# EAGLE design UwU Bot (EAGLE 9.6.2)
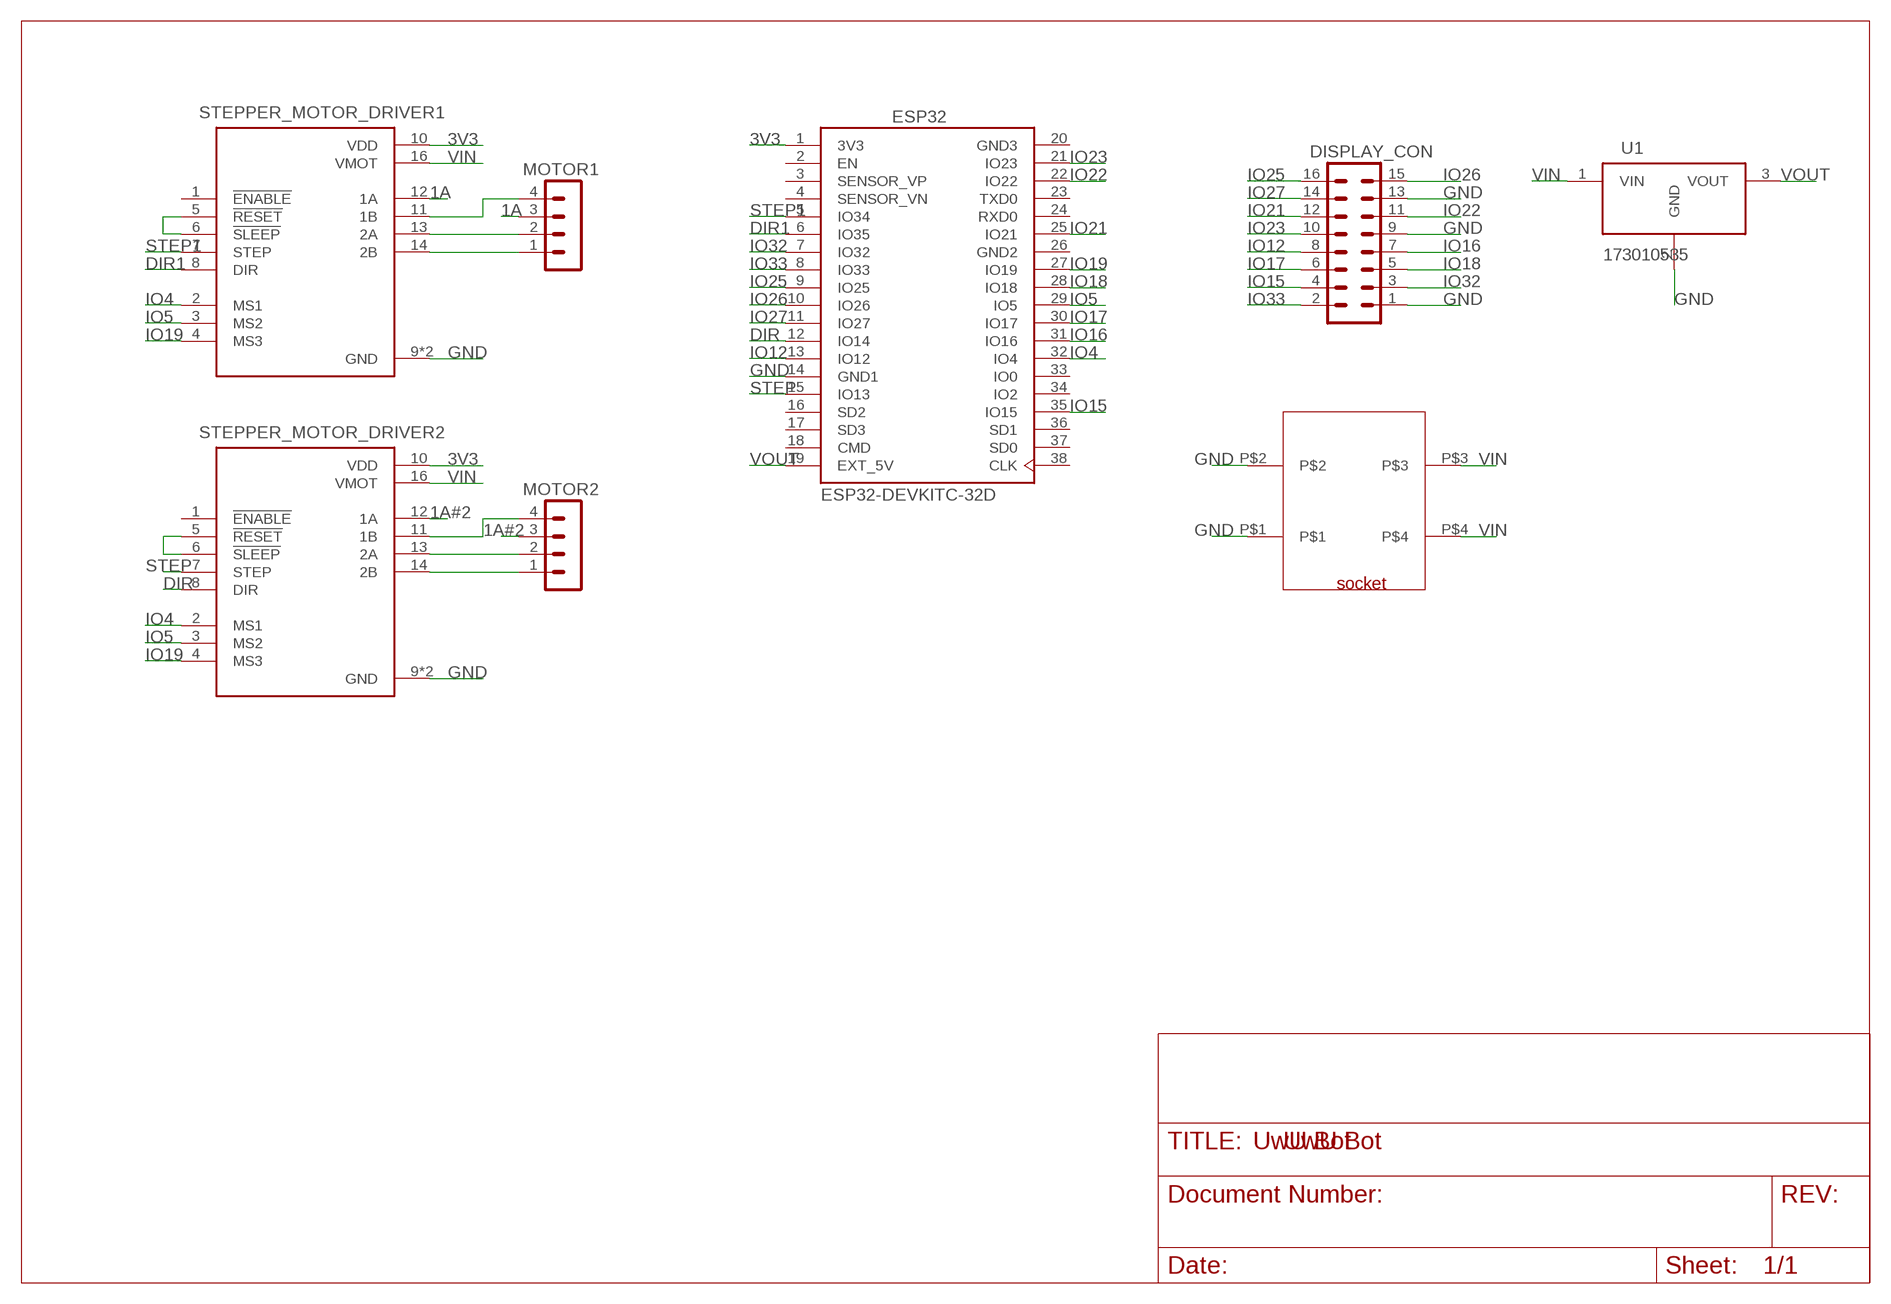
[diagram p0: schematic, sheet 1]

## Parts
DISPLAY_CON  MA08-2  [MA08-2]
ESP32  ESP32-DEVKITC-32D  [MODULE_ESP32-DEVKITC-32D]
MOTOR1  MA04-1  [MA04-1]
MOTOR2  MA04-1  [MA04-1]
STEPPER_MOTOR_DRIVER1  A4988_STEPPER_MOTOR_DRIVER_CARRIER_BLACK  [MODULE_A4988_STEPPER_MOTOR_DRIVER_CARRIER_BLACK]
STEPPER_MOTOR_DRIVER2  A4988_STEPPER_MOTOR_DRIVER_CARRIER_BLACK  [MODULE_A4988_STEPPER_MOTOR_DRIVER_CARRIER_BLACK]
U1  173010535  [173010535]
U$1  BUCHSEDC  [BUCHSE]

## Nets
1A: MOTOR1.3 STEPPER_MOTOR_DRIVER1.12(1A)
1A#2: MOTOR2.3 STEPPER_MOTOR_DRIVER2.12(1A)
3V3: ESP32.1(3V3) STEPPER_MOTOR_DRIVER1.10(VDD) STEPPER_MOTOR_DRIVER2.10(VDD)
DIR: ESP32.12(IO14) STEPPER_MOTOR_DRIVER2.8(DIR)
DIR1: ESP32.6(IO35) STEPPER_MOTOR_DRIVER1.8(DIR)
GND: DISPLAY_CON.1 DISPLAY_CON.9 DISPLAY_CON.13 ESP32.14(GND1) STEPPER_MOTOR_DRIVER1.9(GND) STEPPER_MOTOR_DRIVER1.15(GND) STEPPER_MOTOR_DRIVER2.9(GND) STEPPER_MOTOR_DRIVER2.15(GND) U1.2(GND) U$1.P$1 U$1.P$2
IO4: ESP32.32(IO4) STEPPER_MOTOR_DRIVER1.2(MS1) STEPPER_MOTOR_DRIVER2.2(MS1)
IO5: ESP32.29(IO5) STEPPER_MOTOR_DRIVER1.3(MS2) STEPPER_MOTOR_DRIVER2.3(MS2)
IO12: DISPLAY_CON.8 ESP32.13(IO12)
IO15: DISPLAY_CON.4 ESP32.35(IO15)
IO16: DISPLAY_CON.7 ESP32.31(IO16)
IO17: DISPLAY_CON.6 ESP32.30(IO17)
IO18: DISPLAY_CON.5 ESP32.28(IO18)
IO19: ESP32.27(IO19) STEPPER_MOTOR_DRIVER1.4(MS3) STEPPER_MOTOR_DRIVER2.4(MS3)
IO21: DISPLAY_CON.12 ESP32.25(IO21)
IO22: DISPLAY_CON.11 ESP32.22(IO22)
IO23: DISPLAY_CON.10 ESP32.21(IO23)
IO25: DISPLAY_CON.16 ESP32.9(IO25)
IO26: DISPLAY_CON.15 ESP32.10(IO26)
IO27: DISPLAY_CON.14 ESP32.11(IO27)
IO32: DISPLAY_CON.3 ESP32.7(IO32)
IO33: DISPLAY_CON.2 ESP32.8(IO33)
N$1: MOTOR1.4 STEPPER_MOTOR_DRIVER1.11(1B)
N$2: STEPPER_MOTOR_DRIVER1.5(!RESET) STEPPER_MOTOR_DRIVER1.6(!SLEEP)
N$3: STEPPER_MOTOR_DRIVER2.5(!RESET) STEPPER_MOTOR_DRIVER2.6(!SLEEP)
N$4: MOTOR2.4 STEPPER_MOTOR_DRIVER2.11(1B)
N$26: MOTOR2.2 STEPPER_MOTOR_DRIVER2.13(2A)
N$27: MOTOR2.1 STEPPER_MOTOR_DRIVER2.14(2B)
N$28: MOTOR1.1 STEPPER_MOTOR_DRIVER1.14(2B)
N$29: MOTOR1.2 STEPPER_MOTOR_DRIVER1.13(2A)
STEP: ESP32.15(IO13) STEPPER_MOTOR_DRIVER2.7(STEP)
STEP1: ESP32.5(IO34) STEPPER_MOTOR_DRIVER1.7(STEP)
VIN: STEPPER_MOTOR_DRIVER1.16(VMOT) STEPPER_MOTOR_DRIVER2.16(VMOT) U1.1(VIN) U$1.P$3 U$1.P$4
VOUT: ESP32.19(EXT_5V) U1.3(VOUT)
Unconnected: ESP32.2(EN) ESP32.3(SENSOR_VP) ESP32.4(SENSOR_VN) ESP32.16(SD2) ESP32.17(SD3) ESP32.18(CMD) ESP32.23(TXD0) ESP32.24(RXD0) ESP32.33(IO0) ESP32.34(IO2) ESP32.36(SD1) ESP32.37(SD0) ESP32.38(CLK) STEPPER_MOTOR_DRIVER1.1(!ENABLE) STEPPER_MOTOR_DRIVER2.1(!ENABLE)

## Notes on the sheet
- UwU Bot

## Power pins joined to a net without a drawn wire
GND2: ESP32.26(GND2)
GND3: ESP32.20(GND3)

## Library data of the parts
DISPLAY_CON = con-lstb:MA08-2: PIN HEADER; OC_FARNELL: unknown; OC_NEWARK: unknown
ESP32 = ESP32-DEVKITC-32D:ESP32-DEVKITC-32D: Eval Board For Esp-Wroom-32 Check availability <https://pricing.snapeda.com/parts/ESP32-DEVKITC-32D/Espressif%20Systems/view-part?ref=eda>; AVAILABILITY: In Stock; DESCRIPTION: WiFi Development Tools (802.11) ESP32 General Development Kit, ESP32-WROOM-32D on the board; MF: Espressif Systems; MP: ESP32-DEVKITC-32D; PACKAGE: None; PRICE: None; PURCHASE-URL: https://pricing.snapeda.com/search/part/ESP32-DEVKITC-32D/?ref=eda
MOTOR1 MOTOR2 = con-lstb:MA04-1: PIN HEADER; OC_FARNELL: unknown; OC_NEWARK: unknown
STEPPER_MOTOR_DRIVER1 STEPPER_MOTOR_DRIVER2 = A4988_STEPPER_MOTOR_DRIVER_CARRIER_BLACK:A4988_STEPPER_MOTOR_DRIVER_CARRIER_BLACK: Stepper motor controler; IC: A4988; 1A; Uin mot: 8÷35V Check availability <https://pricing.snapeda.com/parts/A4988%20STEPPER%20MOTOR%20DRIVER%20CARRIER%20BLACK/Pololu/view-part?ref=eda>; AVAILABILITY: Not in stock; DESCRIPTION: Stepper motor controler; IC: A4988; 1.2A; Uin mot: 8÷35V; MF: Pololu; MP: A4988 STEPPER MOTOR DRIVER CARRIER BLACK; PACKAGE: None; PRICE: None
U1 = DC-DC Converter:173010535: FDSM FIXED STEP DOWN REGULATOR M Manufacturer's datasheet <https://www.we-online.com/catalog/datasheet/173010335.pdf>; CREATED_BY: PCBLayout.com; DIGIKEY_PARTNO: 732-173010535-ND; MANUFACTURER: Würth Elektronik; MPN: 173010535
U$1 = buchse:BUCHSE

## Board
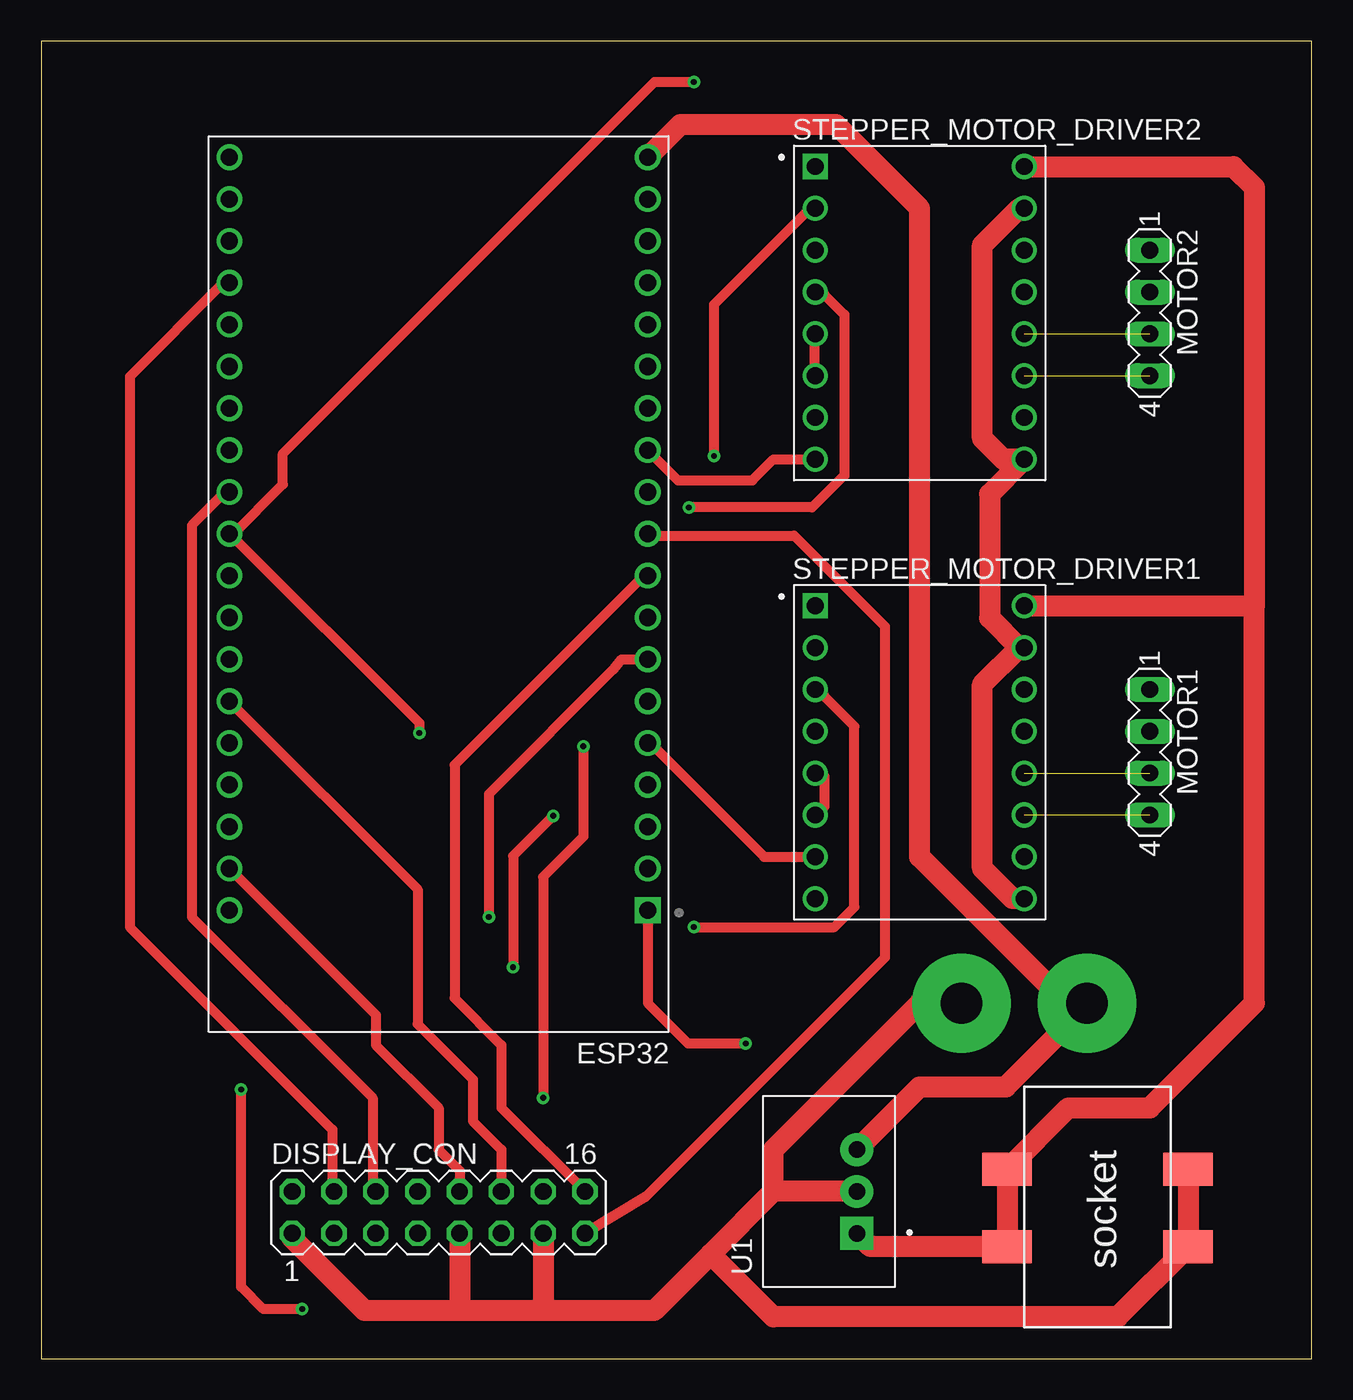
[diagram p1: board, top side]
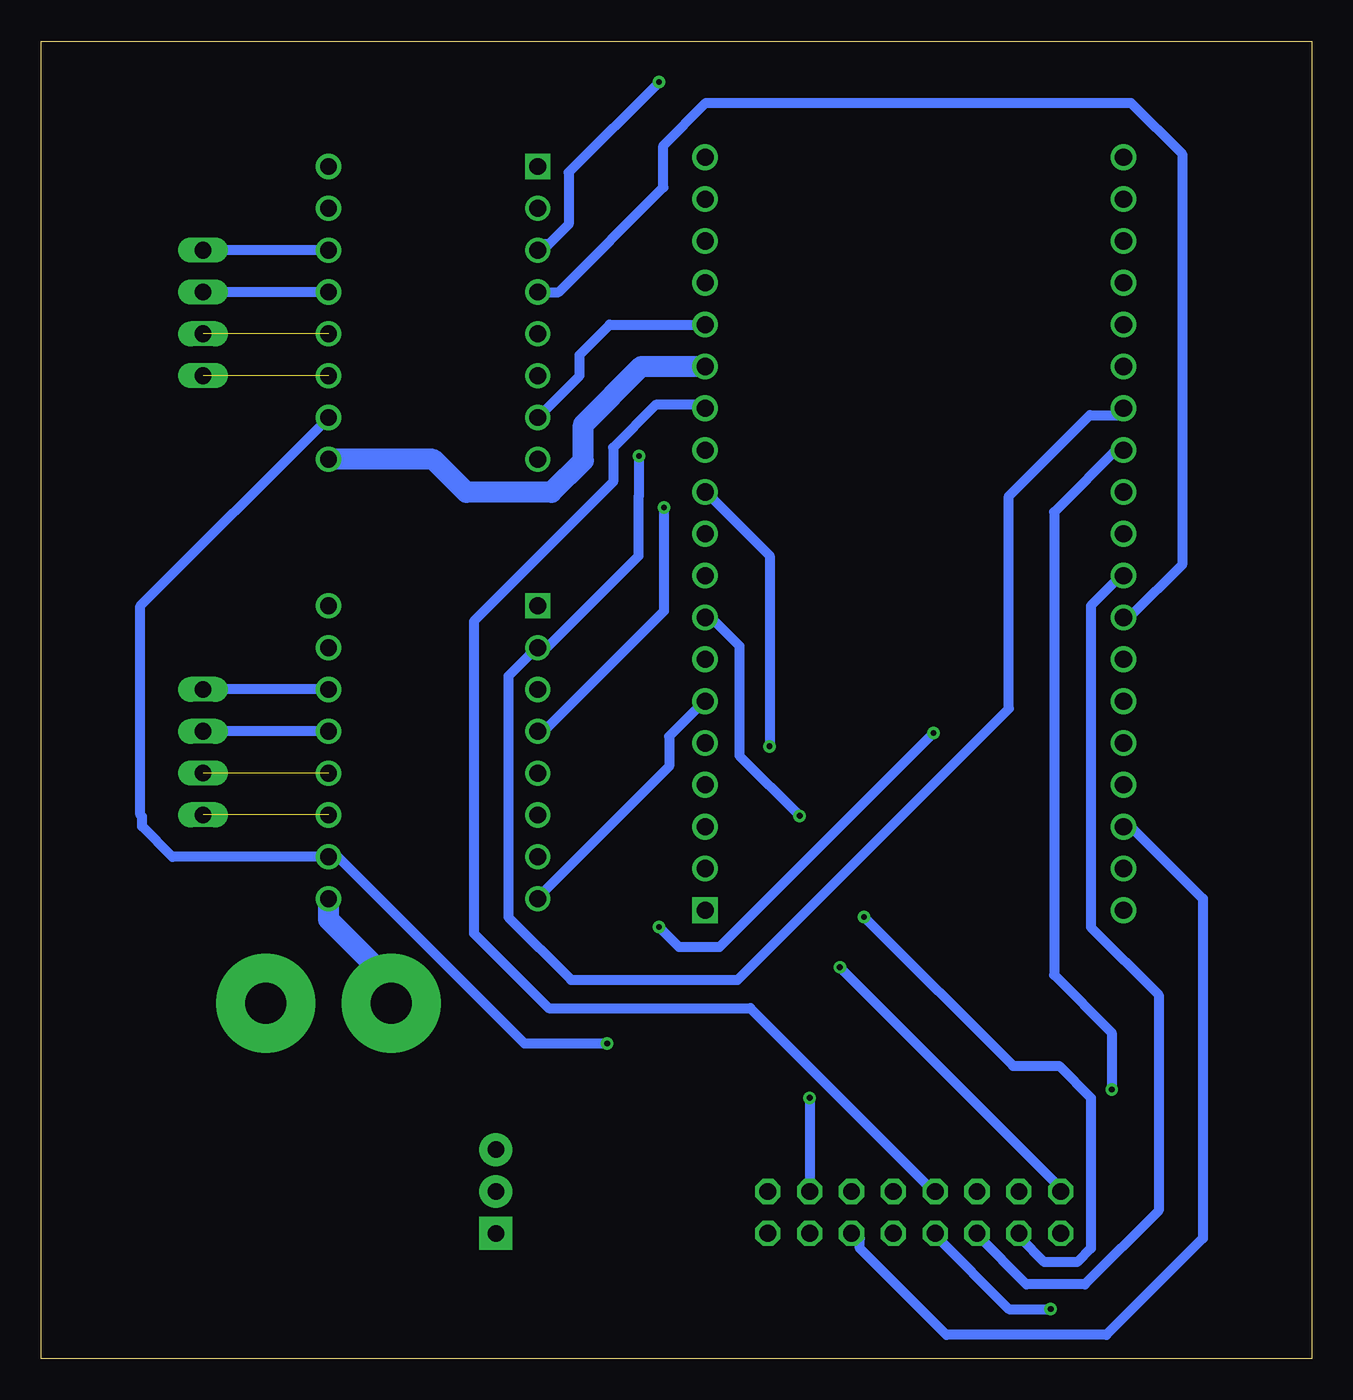
[diagram p2: board, bottom side, seen from below]

Size 77.14 x 80 mm. Coordinates in mm from the lower left corner, seen from the top.
Outline: 0,0 77.14,0 77.14,80 0,80 0,0
Copper layers (1*16): Top 0.035mm / dielectric 1.5mm / Bottom 0.035mm
Design rules "default *": minimum track width 24mil, minimum drill 0.35mm, track to track 24mil, track to pad 24mil, pad to pad 24mil, via to via 24mil, smd to smd 24mil, copper to edge 40mil, drill to drill 6mil, minimum pad ring 10mil, minimum via ring 8mil, stop-mask expansion 4mil, vias tented up to drill 0mil, thermal gap 10mil

### Footprints (pad centres in the part's own frame; a part is rotated, then mirrored left to right if it is on the bottom)
MA08-2 = drill 1.016 octagon: 1 -8.89,-1.27; 2 -8.89,1.27; 3 -6.35,-1.27; 4 -6.35,1.27; 5 -3.81,-1.27; 6 -3.81,1.27; 7 -1.27,-1.27; 8 -1.27,1.27; 9 1.27,-1.27; 10 1.27,1.27; 11 3.81,-1.27; 12 3.81,1.27; 13 6.35,-1.27; 14 6.35,1.27; 15 8.89,-1.27; 16 8.89,1.27
MODULE_ESP32-DEVKITC-32D = drill 1.04 square: 1 -12.7,19.76 | drill 1.04: 2 -12.7,17.22; 3 -12.7,14.68; 4 -12.7,12.14; 5 -12.7,9.6; 6 -12.7,7.06; 7 -12.7,4.52; 8 -12.7,1.98; 9 -12.7,-0.56; 10 -12.7,-3.1; 11 -12.7,-5.64; 12 -12.7,-8.18; 13 -12.7,-10.72; 14 -12.7,-13.26; 15 -12.7,-15.8; 16 -12.7,-18.34; 17 -12.7,-20.88; 18 -12.7,-23.42; 19 -12.7,-25.96; 20 12.7,19.76; 21 12.7,17.22; 22 12.7,14.68; 23 12.7,12.14; 24 12.7,9.6; 25 12.7,7.06; 26 12.7,4.52; 27 12.7,1.98; 28 12.7,-0.56; 29 12.7,-3.1; 30 12.7,-5.64; 31 12.7,-8.18; 32 12.7,-10.72; 33 12.7,-13.26; 34 12.7,-15.8; 35 12.7,-18.34; 36 12.7,-20.88; 37 12.7,-23.42; 38 12.7,-25.96
MA04-1 = drill 1.016 long: 1 -3.81,0; 2 -1.27,0; 3 1.27,0; 4 3.81,0
MODULE_A4988_STEPPER_MOTOR_DRIVER_CARRIER_BLACK = drill 1.02 square: 1 -6.35,8.89 | drill 1.02: 2 -6.35,6.35; 3 -6.35,3.81; 4 -6.35,1.27; 5 -6.35,-1.27; 6 -6.35,-3.81; 7 -6.35,-6.35; 8 -6.35,-8.89; 9 6.35,-8.89; 10 6.35,-6.35; 11 6.35,-3.81; 12 6.35,-1.27; 13 6.35,1.27; 14 6.35,3.81; 15 6.35,6.35; 16 6.35,8.89
173010535 = drill 1 pad 2 square: 1 -2.54,0 | drill 1 pad 2: 2 0,0; 3 2.54,0
BUCHSE = smd 2 x 3: P$1 5,9.95; P$2 9.7,9.95; P$3 5,-1.05; P$4 9.7,-1.05

### Placement (x,y rotation side)
DISPLAY_CON  24.13,8.89 0 top
ESP32  24.13,46.99 180 top
MOTOR1  67.31,36.83 270 top
MOTOR2  67.31,63.5 270 top
STEPPER_MOTOR_DRIVER1  53.34,36.83 0 top
STEPPER_MOTOR_DRIVER2  53.34,63.5 0 top
U1  49.53,10.16 90 top
U$1  59.69,16.51 270 top

### Tracks (layer width: path | path; a pad name or v marks a point on that pad's centre or on a via)
1A  (1 unrouted)
1A#2  (1 unrouted)
3V3  (via drill 0.35)
  Top 0.61: ESP32.1 36.83,21.59 39.27,19.15 v42.77,19.15
  Bottom 0.61: STEPPER_MOTOR_DRIVER2.10 71.12,45.72 71.12,33.02 71.02,32.92 71.02,32.33 69.17,30.48 STEPPER_MOTOR_DRIVER1.10 59.13,30.48 47.8,19.15 v42.77,19.15
DIR
  Top 0.61: ESP32.12 38.66,53.34 43.18,53.34 44.45,54.61 STEPPER_MOTOR_DRIVER2.8
DIR1
  Bottom 0.61: STEPPER_MOTOR_DRIVER1.8 46.94,28.04 39.01,35.97 39.01,37.8 37.19,39.62 ESP32.6
GND  (via drill 2.5 pad 6)
  Top 1.27: U1.2 44.45,10.16 | 30.48,2.92 37.21,2.92 40.64,6.35 | 30.48,2.92 25.4,2.92 | 44.45,10.16 40.64,6.35 | DISPLAY_CON.13 30.48,2.92 | DISPLAY_CON.9 25.4,2.92 | U$1.P$1 U$1.P$2 65.37,2.54 44.45,2.54 40.64,6.35 | 44.45,10.16 44.45,12.7 53.34,21.59 v55.88,21.59 | 25.4,2.92 19.64,2.92 15.24,7.32 DISPLAY_CON.1 | STEPPER_MOTOR_DRIVER1.9 58.99,27.94 57.15,29.78 57.15,40.94 59.39,43.18 | STEPPER_MOTOR_DRIVER2.15 59.39,69.85 57.15,67.61 57.15,55.88 58.42,54.61 STEPPER_MOTOR_DRIVER2.9 57.58,52.5 57.58,44.99 59.39,43.18 | 59.39,43.18 STEPPER_MOTOR_DRIVER1.15
  Bottom 1.27: v55.88,21.59 55.88,22.86 59.69,26.67 STEPPER_MOTOR_DRIVER1.9 | STEPPER_MOTOR_DRIVER2.9 53.34,54.61 51.33,52.6 46.16,52.6 44.22,54.54 44.22,56.73 40.7,60.25 ESP32.14
IO4  (via drill 0.35)
  Top 0.61: v40.84,54.81 40.84,64.01 46.94,70.1 STEPPER_MOTOR_DRIVER2.2
  Bottom 0.61: ESP32.32 11.58,57.3 13.46,57.3 18.39,52.38 18.39,39.47 34.85,23.01 44.96,23.01 48.77,26.82 48.77,41.45 47.55,42.67 STEPPER_MOTOR_DRIVER1.2 46.94,43.28 46.33,43.28 40.87,48.74 40.87,52.35 40.84,52.37 v40.84,54.81
IO5  (via drill 0.35)
  Top 0.61: v39.62,26.21 48.16,26.21 49.38,27.43 49.38,38.41 47.55,40.23 STEPPER_MOTOR_DRIVER1.3 | v39.62,77.52 37.24,77.52 14.68,54.97 14.68,53.09 11.58,49.99 | 11.58,49.99 ESP32.29 | v22.96,38 22.96,38.61 11.58,49.99
  Bottom 0.61: v39.62,26.21 38.41,24.99 35.97,24.99 v22.96,38 | v39.62,77.52 45.11,72.03 45.11,68.89 46.33,67.67 46.94,67.67 STEPPER_MOTOR_DRIVER2.3
IO12
  Bottom 0.61: DISPLAY_CON.8 23.16,10.36 34.09,21.29 46.33,21.29 50.88,25.83 50.88,44.78 42.42,53.24 42.42,55.32 39.83,57.91 37.19,57.91 ESP32.13
IO15
  Top 0.61: DISPLAY_CON.4 17.68,10.36 17.68,13.92 5.38,26.21 5.38,59.64 10.97,65.23 ESP32.35
IO16  (via drill 0.35)
  Top 0.61: v15.85,3.02 13.49,3.02 12.14,4.37 v12.14,16.36
  Bottom 0.61: DISPLAY_CON.7 22.86,7.49 18.39,3.02 v15.85,3.02 | v12.14,16.36 12.14,19.81 15.65,23.32 15.65,51.41 11.58,55.47 ESP32.31
IO17
  Top 0.61: DISPLAY_CON.6 20.12,10.36 20.12,15.85 9.14,26.82 9.14,50.6 10.97,52.43 ESP32.30
IO18
  Bottom 0.61: DISPLAY_CON.5 20.32,7.52 17.32,4.52 13.77,4.52 9.3,8.99 9.3,22.1 13.41,26.21 13.41,45.72 11.58,47.55 ESP32.28
IO19  (via drill 0.35)
  Top 0.61: v39.32,51.69 46.81,51.69 48.77,53.65 48.77,63.4 47.55,64.62 STEPPER_MOTOR_DRIVER2.4
  Bottom 0.61: STEPPER_MOTOR_DRIVER1.4 46.94,38.41 46.33,38.41 39.32,45.41 v39.32,51.69 | ESP32.27 10.97,45.11 7.87,48.21 7.87,73.15 10.97,76.25 36.78,76.25 39.37,73.66 39.37,71.12 45.72,64.77 STEPPER_MOTOR_DRIVER2.4
IO21
  Top 0.61: ESP32.25 22.86,28.5 22.86,20.32 26.21,16.96 26.21,14.43 27.94,12.7 DISPLAY_CON.12
IO22
  Bottom 0.61: DISPLAY_CON.11 27.43,7.32 27.43,6.71 22.17,1.45 12.47,1.45 6.6,7.32 6.6,27.94 10.97,32.31 ESP32.22
IO23
  Top 0.61: ESP32.21 20.32,20.88 20.32,19.05 24.13,15.24 24.13,12.7 25.4,11.43 DISPLAY_CON.10
IO25
  Top 0.61: ESP32.9 36.58,47.55 25.09,36.07 25.09,21.89 27.94,19.05 27.94,15.24 DISPLAY_CON.16
IO26
  Top 0.61: DISPLAY_CON.15 36.7,9.83 51.23,24.36 51.23,44.48 45.72,49.99 37.19,49.99 ESP32.10
IO27  (via drill 0.35)
  Top 0.61: v30.48,15.85 30.48,29.26 32.92,31.7 v32.92,37.19
  Bottom 0.61: v30.48,15.85 DISPLAY_CON.14 | v32.92,37.19 32.92,48.77 36.58,52.43 ESP32.11
IO32  (via drill 0.35)
  Top 0.61: v27.18,26.82 27.18,34.29 34.74,41.85 35.23,42.47 ESP32.7
  Bottom 0.61: DISPLAY_CON.3 17.68,7.32 16.23,5.87 14.25,5.87 13.41,6.71 13.41,15.85 15.34,17.78 18.14,17.78 v27.18,26.82
IO33  (via drill 0.35)
  Top 0.61: v28.65,23.77 28.65,30.53 v31.09,32.97
  Bottom 0.61: v28.65,23.77 15.24,10.36 DISPLAY_CON.2 | ESP32.8 36.58,45.11 34.75,43.28 34.75,36.63 v31.09,32.97
N$1  (1 unrouted)
N$2
  Top 0.61: STEPPER_MOTOR_DRIVER1.6 47.55,33.53 47.55,35.36 STEPPER_MOTOR_DRIVER1.5
N$3
  Top 0.61: STEPPER_MOTOR_DRIVER2.6 46.94,59.74 46.94,62.18 STEPPER_MOTOR_DRIVER2.5
N$4  (1 unrouted)
N$26
  Bottom 0.61: STEPPER_MOTOR_DRIVER2.13 MOTOR2.2
N$27
  Bottom 0.61: STEPPER_MOTOR_DRIVER2.14 MOTOR2.1
N$28
  Bottom 0.61: STEPPER_MOTOR_DRIVER1.14 MOTOR1.1
N$29
  Bottom 0.61: STEPPER_MOTOR_DRIVER1.13 MOTOR1.2
STEP
  Bottom 0.61: STEPPER_MOTOR_DRIVER2.7 44.45,59.69 44.45,60.96 42.62,62.79 ESP32.15
STEP1
  Top 0.61: STEPPER_MOTOR_DRIVER1.7 43.89,30.48 37.19,37.19 ESP32.5
VIN
  Top 1.27: U1.1 50.34,6.81 U$1.P$4 U$1.P$3 62.37,15.24 67.31,15.24 73.66,21.59 73.66,45.72 | STEPPER_MOTOR_DRIVER2.16 72.39,72.39 73.66,71.12 73.66,45.72 | STEPPER_MOTOR_DRIVER1.16 73.66,45.72
VOUT  (via drill 2.5 pad 6)
  Top 0.61: 63.4,21.34 v63.5,21.59
  Top 1.27: U1.3 53.34,16.51 58.57,16.51 63.4,21.34 | v63.5,21.59 62.23,21.59 53.34,30.48 53.34,69.85 48.26,74.93 38.81,74.93 ESP32.19